# Altium schematic sheet MotorDriver_TB6612.SchDoc
size A
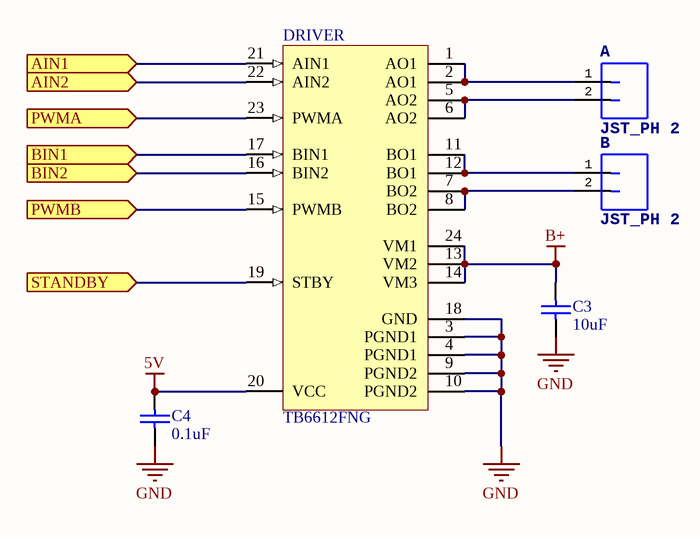
[diagram p0: MotorDriver_TB6612.SchDoc]

## Parts
A  JST_PH 2  [JST-2-PTH-VERT]
B  JST_PH 2  [JST-2-PTH-VERT]
C3  10uF  [CAPC1210(3225)155_N]
C4  0.1uF  [CAPC0603(1608)100_L]
DRIVER  TB6612FNG  [TOSH-SSOP-24_M]

## Ports
AIN1 (in), AIN2 (in), BIN1 (in), BIN2 (in), PWMA (in), PWMB (in), STANDBY (in)

## Nets
5V: C4.2 DRIVER.20(VCC)
B+: C3.2 DRIVER.13(VM2) DRIVER.14(VM3) DRIVER.24(VM1)
GND: C3.1 C4.1 DRIVER.3(PGND1) DRIVER.4(PGND1) DRIVER.9(PGND2) DRIVER.10(PGND2) DRIVER.18(GND)
AIN1: DRIVER.21(AIN1) ; port AIN1
AIN2: DRIVER.22(AIN2) ; port AIN2
BIN1: DRIVER.17(BIN1) ; port BIN1
BIN2: DRIVER.16(BIN2) ; port BIN2
PWMA: DRIVER.23(PWMA) ; port PWMA
PWMB: DRIVER.15(PWMB) ; port PWMB
STANDBY: DRIVER.19(STBY) ; port STANDBY
NetA_1: A.1 DRIVER.1(AO1) DRIVER.2(AO1)
NetA_2: A.2 DRIVER.5(AO2) DRIVER.6(AO2)
NetB_1: B.1 DRIVER.11(BO1) DRIVER.12(BO1)
NetB_2: B.2 DRIVER.7(BO2) DRIVER.8(BO2)

## Library data of the parts
C3 = CMP-1038-02231-1: CAP 10uF 25V -20% to +80% 1210 (3225 Metric) Thickness 1.45mm SMD; Case-Metric: 3225; Case-EIA: 1210; Technology: SMT; Value: 10uF; Rated Voltage: 25 V; Max Thickness: 1.45 mm; Tolerance: -20% to +80%
C4 = CMP-1035-02591-1: CAP 100nF 50V ±5% 0603 (1608 Metric) Thickness 1mm SMD; Tolerance: Â±5%; Case-Metric: 1608; Case-EIA: 0603; Rated Voltage: 50 V; Max Thickness: 1 mm; Technology: SMT; Value: 100nF
DRIVER = CMP-1773-00001-1: Driver IC for Dual DC Motor, 15 V, -20 to 85 degC, 24-Pin SSOP, RoHS, Tape and Reel; Elements: 2; Max Power Dissipation: 200 mW; Max Surge Current: 100 mA; Element Configuration: Common Cathode; Case\Package: TO-236-3; Forward Voltage: 1 V; Peak Reverse Current: 0.1 uA; Forward Current: 70 mA; Recovery Time: 5 ns; Radiation Hardening: No; Packaging: Tape and Reel; ComponentLink2Description: Datasheet; REACH SVHC: No SVHC; ComponentLink2URL: https://toshiba.semicon-storage.com/info/docget.jsp?did=10660&prodName=TB6612FNG; RoHSCompliant: true; DatasheetVersion: Oct-14; PackageDescription: 24-Pin Shrink Small Outline Package Integrated Circuit, Body 7.8 x 5.6 mm, Pitch 0.65 mm; Package Quantity: 3000; Length: 3 mm; Pins: 3; Mount: Surface Mount; ComponentLink1Description: Manufacturer URL; PackageReference: SSOP-24; ComponentLink1URL: http://www.toshiba.com/; Width: 1.4 mm; Max Operating Temperature: 125 degC; Height: 1.1 mm; Min Operating Temperature: -55 degC